# Altium schematic sheet Sheet1.SchDoc
size A; SheetNumber: 1; SheetTotal: 1
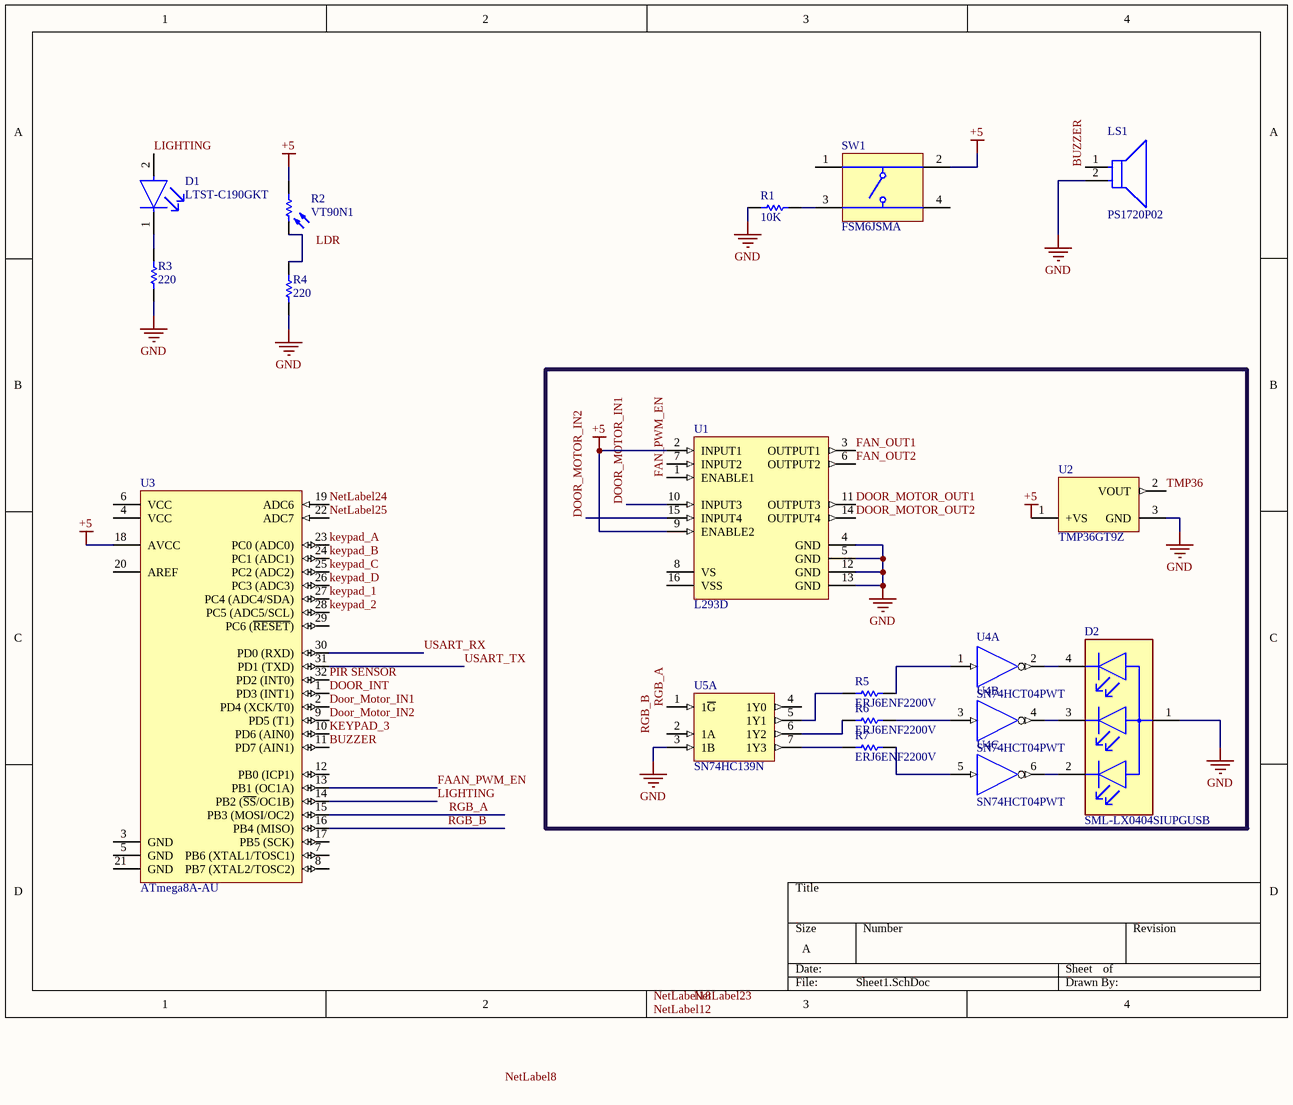
[diagram p0: Sheet1.SchDoc]

## Parts
D1  LTST-C190GKT  [FP-LTST-C190GKT-MFG]
D2  SML-LX0404SIUPGUSB  [FP-SML-LX0404SIUPGUSB-MFG]
LS1  PS1720P02  [FP-PS1720P02-MFG]
R1  value 10K  (hidden comment: Resistor)
R2  VT90N1  [EXCE-VT90N1]
R3  value 220  (hidden comment: Resistor)
R4  value 220  (hidden comment: Resistor)
R5  ERJ6ENF2200V  [RESC2013X70X40NL20T20]
R6  ERJ6ENF2200V  [RESC2013X70X40NL20T20]
R7  ERJ6ENF2200V  [RESC2013X70X40NL20T20]
SW1  FSM6JSMA  [TECO-FSM6JSMA_V]
U1  L293D  [STM-L293D-16]
U2  TMP36GT9Z  [ADI-T-3]
U3  ATmega8A-AU  [32A_N]
U4  SN74HCT04PWT  [PW0014A_N]  (parts A,B,C of 7)
U5  SN74HC139N  [N0016A]  (part A of 3)

## Nets
+5: R2.1 SW1.2 U1.2(INPUT1) U1.9(ENABLE2) U2.1(+VS) U3.18(AVCC)
GND: D2.1(Common_Anode) LS1.2 R1.1 R3.1 R4.1 U1.4(GND) U1.5(GND) U1.12(GND) U1.13(GND) U2.3(GND) U5.3(1B)
BUZZER: LS1.1 U3.11(PD7_(AIN1))
DOOR_INT: U3.1(PD3_(INT1))
Door_Motor_IN1: U1.10(INPUT3) U3.2(PD4_(XCK/T0))
Door_Motor_IN2: U1.15(INPUT4) U3.9(PD5_(T1))
DOOR_MOTOR_OUT1: U1.11(OUTPUT3)
DOOR_MOTOR_OUT2: U1.14(OUTPUT4)
FAAN_PWM_EN: U3.13(PB1_(OC1A))
FAN_OUT1: U1.3(OUTPUT1)
FAN_OUT2: U1.6(OUTPUT2)
FAN_PWM_EN: U1.1(ENABLE1)
keypad_1: U3.27(PC4_(ADC4/SDA))
keypad_2: U3.28(PC5_(ADC5/SCL))
KEYPAD_3: U3.10(PD6_(AIN0))
keypad_A: U3.23(PC0_(ADC0))
keypad_B: U3.24(PC1_(ADC1))
keypad_C: U3.25(PC2_(ADC2))
keypad_D: U3.26(PC3_(ADC3))
LIGHTING: D1.2(A) U3.14(PB2_(~{SS}/OC1B))
NetLabel24: U3.19(ADC6)
NetLabel25: U3.22(ADC7)
PIR SENSOR: U3.32(PD2_(INT0))
RGB_A: U3.15(PB3_(MOSI/OC2)) U5.1(1~{G})
RGB_B: U3.16(PB4_(MISO))
TMP36: U2.2(VOUT)
USART_RX: U3.30(PD0_(RXD))
USART_TX: U3.31(PD1_(TXD))
NetD1_1: D1.1(C) R3.2
NetD2_2: D2.2(Red_C) U4.6(~{3Y})
NetD2_3: D2.3(Blue_C) U4.4(~{2Y})
NetD2_4: D2.4(Green_C) U4.2(~{1Y})
NetR1_2: R1.2 SW1.3
NetR2_2: R2.2 R4.2
NetR5_1: R5.1 U5.5(1Y1)
NetR5_2: R5.2 U4.1(1A)
NetR6_1: R6.1 U5.6(1Y2)
NetR6_2: R6.2 U4.3(2A)
NetR7_1: R7.1 U5.7(1Y3)
NetR7_2: R7.2 U4.5(3A)

Not connected (* = marked no-connect by the designer): SW1 1 4; U1 7(INPUT2) 8(VS) 16(VSS); U3 3(GND) 4(VCC) 5(GND) 6(VCC) 7(PB6_(XTAL1/TOSC1)) 8(PB7_(XTAL2/TOSC2)) 12(PB0_(ICP1)) 17(PB5_(SCK)) 20(AREF) 21(GND) 29(PC6_(~{RESET})); U5 2(1A) 4(1Y0)

## Notes on the sheet
- Labels drawn without touching a wire or pin: LDR, NetLabel8, NetLabel12, NetLabel18, NetLabel23, RGB_B

## Library data of the parts
D1 = CMP-22017-000005-2: LED GREEN CLEAR CHIP SMD; Dominant Wavelength: 569nm; Reverse Voltage: 5V; Lens Color: Colorless; Viewing Angle: 130°; Voltage: 2V; Forward Current: 30mA; Power Dissipation: 100mW; Luminous Intensity: 6mcd; Number of LEDs: 1; Forward Voltage: 2.1V; Wavelength: 565nm; Test Current: 10mA; Min Operating Temperature: -55°C; Lens Style: Clear; Mount: Surface Mount; Width: 0.8mm; Packaging: Tape and Reel; Lens Transparency: Clear; Case Code (Metric): 1608; Depth: 0.8mm; Case Code (Imperial): 0603; Case/Package: 0603; Number of Pins: 2; Max Operating Temperature: 85°C; Lead Free: Lead Free; Number of Elements: 1; Length: 1.6mm; Height: 0.8mm; Package Quantity: 1; Power Rating: 100mW; Radiation Hardening: No; Illumination Color: Green; Color: Green
D2 = CMP-2000-07119-2: LED RGB CLEAR SMD; Test Current: 2mA; Wavelength: 465nm; Color: Blue; Lens Style: Square; Power Rating: 30mW; Lens Color: Colorless; Number of LEDs: 3; Viewing Angle: 120°; Luminous Intensity: 20mcd; Forward Voltage: 2.73V; Height: 0.3mm; Lead Free: Lead Free; Max Operating Temperature: 85°C; Mount: Surface Mount; REACH SVHC: No SVHC; Case Code (Imperial): 0404; Forward Current: 2mA; Case Code (Metric): 1010; Lens Transparency: Clear; Length: 1mm; Packaging: Tape and Reel; Min Operating Temperature: -40°C; Package Quantity: 2000; Case/Package: 0404; Width: 1mm
LS1 = CMP-08413-000001-1: AUDIO PIEZO TRANSDUCER 30V TH; Manufacturer: TDK Corporation; Description: Audio Buzzer Piezo 3Vo-p Pin Through Hole; Frequency: 2kHz; Standoff Height: 0.5mm; RoHS: TRUE; ComponentLink2URL: https://product.tdk.com/info/en/catalog/datasheets/piezoelectronic_buzzer_ps_en.pdf; ComponentLink2Description: Datasheet; Lead Free: Yes; Temperature Range High: +70°C; Category: Speak; Height: 8.3mm; Device Class L1: Electromechanical; Device Class L3: Buzzers; Package: 0; Mouser Description: Audio Indicators & Alerts Round 17mmx8mm 2 kHz Vin=3V; Manufacturer Part Number: PS1720P02; Digikey Description: AUDIO PIEZO TRANSDUCER 30V TH; Device Class L2: Audio Products; Temperature Range Low: -10°C; Automotive: No; Octopart: https://octopart.com/ps1720p02-tdk-154429; Temperature: -10°C to +70°C
R1 R3 R4 = Resistor: TC1: 0; SimulationGenericComponent: True; TC2: 0
R2 = CMP-2000-07406-1: Photoconductive Resistor, 200 kOhm, 100 V, 80 mW, -40 to 75 degC, 2-Pin THD, RoHS; Manufacturer: Excelitas Technology; SVHC: Cadmiumchloride(15-Jun-2015); Power Rating: 80mW; Resistance @ Lux: 12kohm; Voltage Rating: 100V; Product Range: -; Datasheet Version: 09/2006; Resistor Case Style: -; Operating Temperature Max: 75°C; Package Reference: VT90N1; Datasheet URL: http://datasheet.octopart.com/VT90N1-Excelitas-datasheet-10388451.pdf; Mounting Technology: ThroughHole; Operating Temperature Min: -40°C; Dark Resistance: 200kohm; Package Description: 2-Pin Through Hole Device, Body Width 4.17 mm (Max), Height 2.29 mm; Manufacturer URL: http://www.excelitas.com/Pages/Index.aspx; Packaging: Each
R5-R7 = CMP-2001-00044-1: Manufacturer: Panasonic; Part Number: ERJ6ENF2200V
SW1 = CMP-2000-07503-1: Switch, SPST, 24 V, -35 to 85 degC, 4-Pin SMD, RoHS, Tape and Reel; Manufacturer: TE Connectivity; Electrical Life: 100000Cycles; Voltage Rating (DC): 24V; Contact Resistance: 100mOhm; Case\/Package: SMD/SMT; Actuator Length: 3.4mm; Contact Current Rating: 50mA; Operating Force: 1.57N; Max Voltage Rating (DC): 12V; Illumination Type: Illuminated; Actuator Material: Polyamide; Switch Travel: 0.25mm; Contact Plating: Silver; Mount: SurfaceMount; Contact Material: CopperAlloy; RoHSCompliant: true; Width: 6mm; Package Reference: FSM6JSMA; Manufacturer URL: http://www.te.com/; Min Operating Temperature: -35degC; REACH SVHC: Unknown; Datasheet Version: Rev. V, 02/2015; Package Quantity: 750; Voltage Rating: 24V; Termination: GullWing; Mechanical Life: 100000Cycles; Mounting Technology: SurfaceMount; Insulation Resistance: 100MOhm; Packaging: LoosePiece; Package Description: 4-Pin Surface Mount Device, Body 6 x 6 mm, Pitch 4.5 mm; Orientation: Straight; Max Operating Temperature: 85degC; Length: 6mm; Current Rating: 50mA; Datasheet URL: http://www.te.com/commerce/DocumentDelivery/DDEController?Action=showdoc&DocId=Customer+Drawing%7F2-1437565-7%7FV%7Fpdf%7FEnglish%7FENG_CD_2-1437565-7_V.pdf%7F4-1437565-9; Lead Free: LeadFree; ELV: Compliant; Throw Configuration: SPST
U1 = CMP-2000-06524-1: Push-Pull Four Channel Driver with Diode, 4.5 to 36 V, -40 to 150 degC, 16-Pin PDIP, RoHS, Tube; Manufacturer: STMicroelectronics; Number of Outputs: 4; Current - Peak Output: 1.2A; Current - Output / Channel: 600mA; Input Type: Non-Inverting; Other Related Documents: L293DViewAllSpecifications; Dynamic Catalog: HalfBridge; Voltage - Supply: 4.5V~36V; Other Names: 497-2936-5; Package / Case: 16-DIP(0.300",7.62mm); PartNumber: L293D; Operating Temperature: -40°C~150°C; Datasheet URL: http://www.st.com/st-web-ui/static/active/en/resource/technical/document/datasheet/CD00000059.pdf; Supplier Device Package: 16-PowerDIP; Packaging: Tube; Package Description: 16-Pin Thru-Hole Dual-In-Line, Body 20 x 6.85 mm, Pitch 2.54 mm; Standard Package: 25; Datasheet Version: 07/2003; On-State Resistance: -; Manufacturer URL: http://www.st.com/; Category: IntegratedCircuits(ICs); Family: PMIC-MOSFET,BridgeDrivers-InternalSwitch; Type: HalfBridge; Series: -; Mounting Technology: ThroughHole; Package Reference: DIP-16; Mounting Type: ThroughHole
U2 = CMP-0887-00067-1: Low Voltage Temperature Sensor, 2.7 to 5.5 V Supply, Industrial, 3-pin TO92 (T-3), Tray; Manufacturer: Analog Devices; ComponentLink2Description: Datasheet; PackageReference: T-3; Packing: Tray; ComponentLink2URL: http://www.analog.com/static/imported-files/data_sheets/TMP35_36_37.pdf; ComponentLink4Description: Product URL; ComponentLink3Description: Package Specification; Code_JEDEC: TO-226-AA; PartNumber: TMP36GT9Z; PackageDescription: 3-Pin Plastic Header-Style Package, 1.27 mm Pitch; PackageVersion: 042208-A, 04/2008; ComponentLink3URL: http://www.analog.com/static/imported-files/packages/PKG_PDF/TO-92(T)/T_3.pdf; ComponentLink1Description: Manufacturer URL; Supply Voltage Range: 2.7 to 5.5 V; Mounting Technology: Through Hole; DatasheetVersion: Rev. F; ComponentLink4URL: http://www.analog.com/en/mems-sensors/digital-temperature-sensors/tmp36/products/product.html; ComponentLink1URL: http://www.analog.com/en/index.html
U3 = CMP-0095-00219-2: 8-bit AVR Microcontroller, 2.7-5.5V, 16MHz, 8KB Flash, 512 Bytes EEPROM, 1KB SRAM, 32-pin TQFP, Industrial Grade (-40°C to 85°C); Code_JEDEC: MS-026-ABA; ComponentLink3URL: http://www.atmel.com/dyn/resources/prod_documents/8159S.pdf; PackageDescription: 32-Lead, 7x7x1.0 mm Body, 0.8mm Lead Pitch, Thin Profile Plastic Quad Flat Package (TQFP); DatasheetVersion: revD, Feb-2011; PackageVersion: revC, Oct-2010; ComponentLink2URL: http://www.atmel.com/dyn/resources/prod_documents/doc8159.pdf; RevisionNote: DatasheetVersion & PackageVersion updated. URLs added.; PackageReference: 32A; ComponentLink3Description: ATmega8A Summary; ComponentLink2Description: ATmega8A Datasheet; ComponentLink1Description: Manufacturer URL; ComponentLink1URL: http://www.atmel.com/
U4 = CMP-1615-00087-3: Hex Inverters, PW0014A, SMALL T&R; Manufacturer: Texas Instruments; tpd @ Nom Voltage(Max)(ns): 23; Rating: Catalog; Output Type: CMOS; Bits(#): 6; Input Type: TTL; F @ Nom Voltage(Max)(Mhz): 25; Output Drive (IOL/IOH)(Max)(mA): -4/4; Voltage(Nom)(V): 5; ICC @ Nom Voltage(Max)(mA): 0.02; VCC(Min)(V): 4.5; Schmitt Trigger: No; VCC(Max)(V): 5.5; Technology Family: HCT; DatasheetVersion: SCLS042D; Operating Temperature Range(C): -40 to 85; PackageReference: PW0014A; Code_JEDEC: MO-153; Generic Part Number: SN74HCT04
U5 = CMP-1633-00660-2: Dual 2-Line To 4-Line Decoders/Demultiplexers, N0016A, TUBE; Manufacturer: Texas Instruments; Technology Family: HC; VCC(Min)(V): 2; Voltage(Nom)(V): 3.3,5; F @ Nom Voltage(Max)(Mhz): 28; Output Type: CMOS; Bits(#): 4; VCC(Max)(V): 6; ICC @ Nom Voltage(Max)(mA): 0.08; Function: Decoder/Demultiplexer; Input Type: LVTTL/CMOS; Output Drive (IOL/IOH)(Max)(mA): 5.2/-5.2; Schmitt Trigger: No; Rating: Catalog; Configuration: 2：4; tpd @ Nom Voltage(Max)(ns): 44; Code_JEDEC: MS-001; DatasheetVersion: SCLS108D; Generic Part Number: SN74HC139; Operating Temperature Range(C): -40 to 85; PackageReference: N0016A; Channels(#): 2; Type: Standard